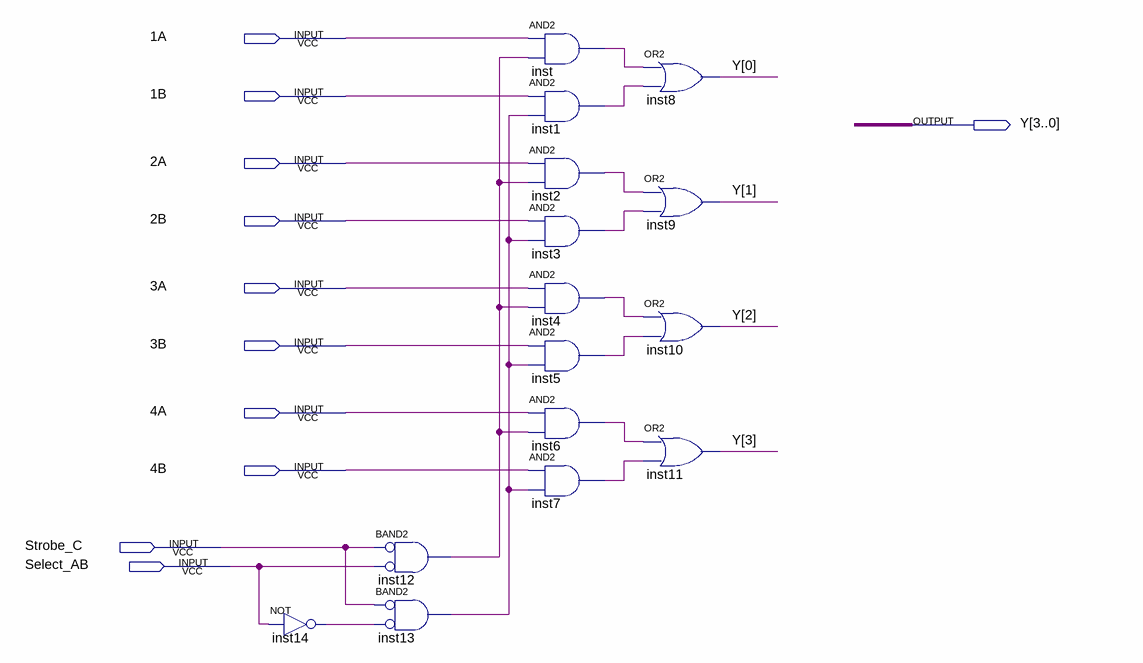
[diagram p0: schematic sheet]
// Quartus schematic 74LS157_Selector.bdf as structural Verilog: 15 symbols, 11 pins
module \74LS157_Selector  (
  input  \1A ,
  input  \1B ,
  input  \2A ,
  input  \2B ,
  input  \3A ,
  input  \3B ,
  input  \4A ,
  input  \4B ,
  input  Strobe_C,
  input  Select_AB,
  output [3:0] Y
);

  wire inst1_out, inst2_out, inst3_out, inst4_out, inst5_out, inst6_out, inst7_out, inst12_out, inst13_out,
       inst14_out, inst_out;

  not inst14 (inst14_out, Select_AB);
  and inst12 (inst12_out, ~Strobe_C, ~Select_AB);  // BAND2
  and inst13 (inst13_out, ~Strobe_C, ~inst14_out);  // BAND2
  and inst (inst_out, \1A , inst12_out);
  and inst1 (inst1_out, \1B , inst13_out);
  and inst2 (inst2_out, \2A , inst12_out);
  and inst3 (inst3_out, \2B , inst13_out);
  and inst4 (inst4_out, \3A , inst12_out);
  and inst5 (inst5_out, \3B , inst13_out);
  and inst6 (inst6_out, \4A , inst12_out);
  and inst7 (inst7_out, \4B , inst13_out);
  or inst8 (Y[0], inst_out, inst1_out);
  or inst9 (Y[1], inst2_out, inst3_out);
  or inst10 (Y[2], inst4_out, inst5_out);
  or inst11 (Y[3], inst6_out, inst7_out);
endmodule
